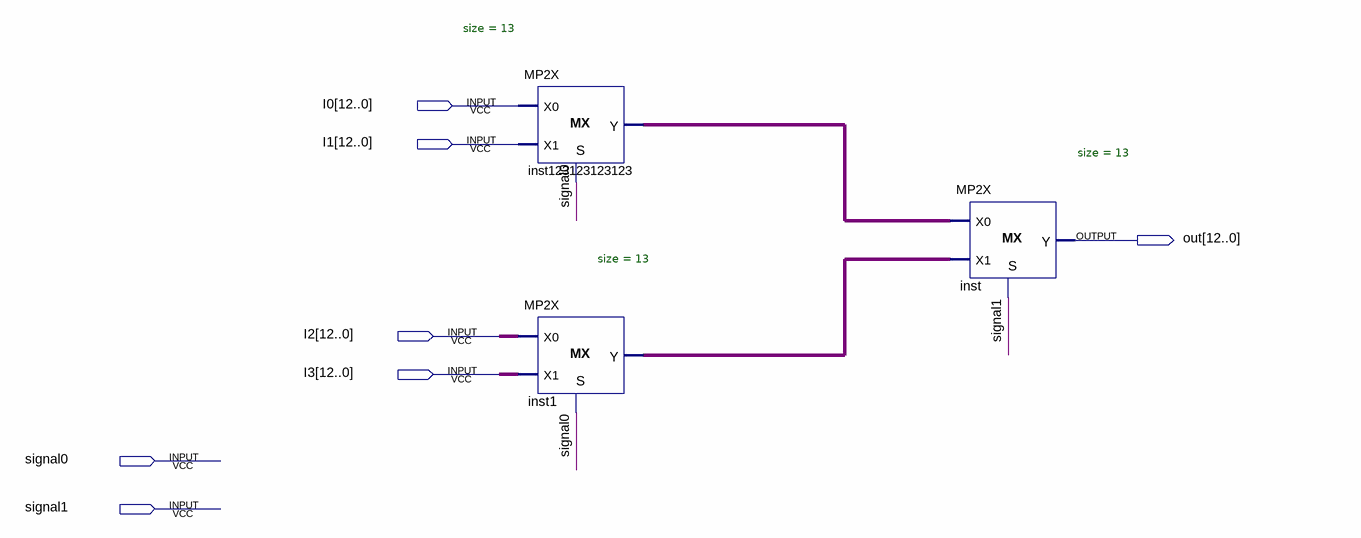
[diagram p0: schematic sheet]
// Quartus schematic MP13_4.bdf as structural Verilog: 3 symbols, 7 pins
module MP13_4 (
  input  [12:0] I0,
  input  [12:0] I1,
  input  [12:0] I2,
  input  [12:0] I3,
  input  signal0,
  input  signal1,
  output [12:0] out
);

  wire [12:0] inst1_y, inst123123123123_y;

  MP2X #(.size(13)) inst123123123123 (.S(signal0), .X0(I0), .X1(I1), .Y(inst123123123123_y));
  MP2X #(.size(13)) inst1 (.S(signal0), .X0(I2), .X1(I3), .Y(inst1_y));
  MP2X #(.size(13)) inst (.S(signal1), .X0(inst123123123123_y), .X1(inst1_y), .Y(out));
endmodule
